# EAGLE design SuperNovaCore (EAGLE 8.7.1)
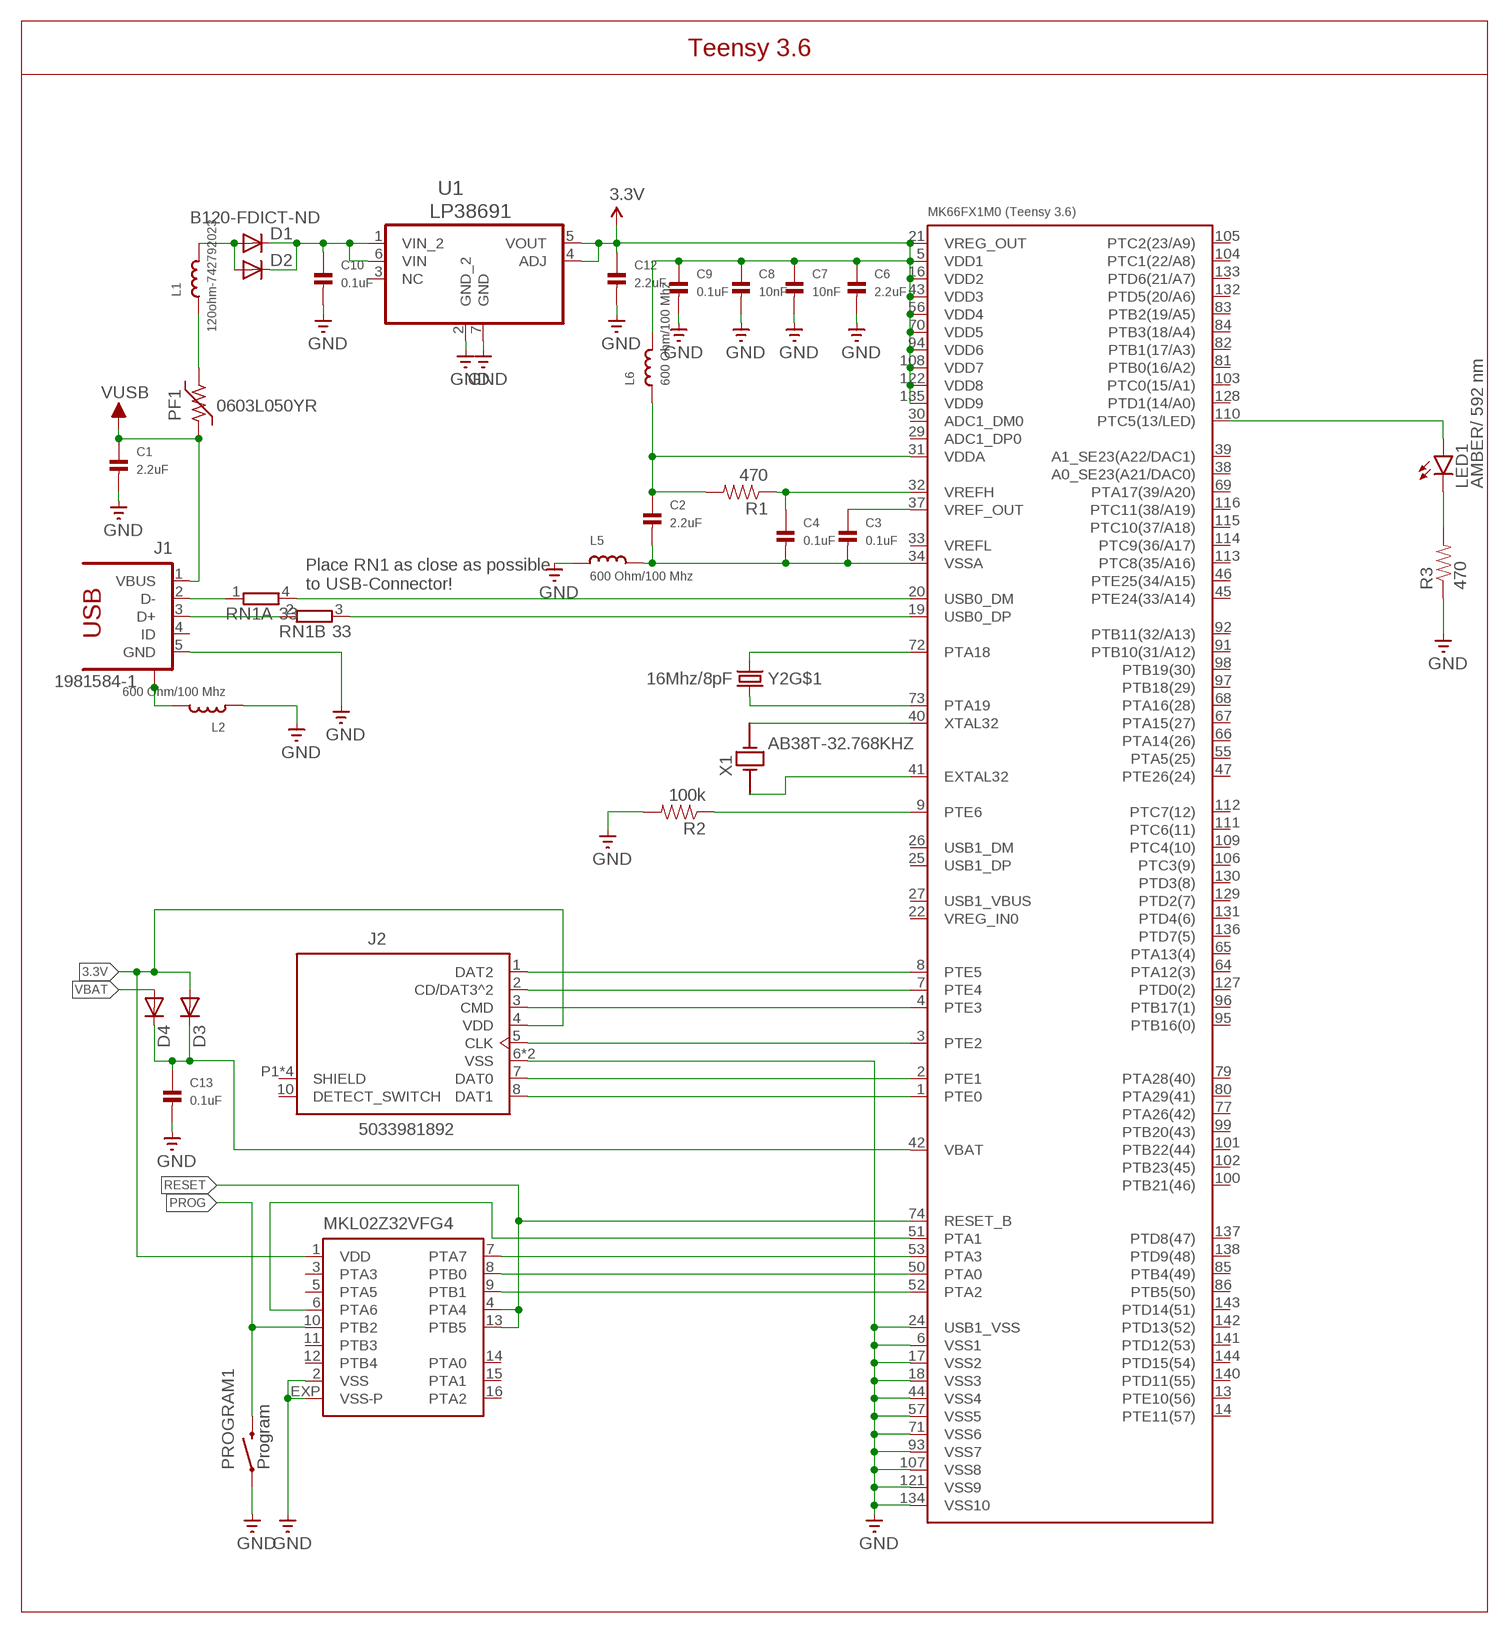
[diagram p0: schematic, sheet 1]

## Parts
C1  2.2uF  CAP_CERAMIC0603  [0603]
C2  2.2uF  CAP_CERAMIC0603  [0603]
C3  0.1uF  CAP_CERAMIC0603  [0603]
C4  0.1uF  CAP_CERAMIC0603  [0603]
C6  2.2uF  CAP_CERAMIC0603  [0603]
C7  10nF  CAP_CERAMIC0603  [0603]
C8  10nF  CAP_CERAMIC0603  [0603]
C9  0.1uF  CAP_CERAMIC0603  [0603]
C10  0.1uF  CAP_CERAMIC0603  [0603]
C12  2.2uF  CAP_CERAMIC0603  [0603]
C13  0.1uF  CAP_CERAMIC0603  [0603]
D1  B120-FDICT-ND  DIODE-DO214AC  [DO214AC]
D2  B120-FDICT-ND  DIODE-DO214AC  [DO214AC]
D3  B120-FDICT-ND  DIODE-DO214AC  [DO214AC]
D4  B120-FDICT-ND  DIODE-DO214AC  [DO214AC]
J1  1981584-1  [1981584-1]
J2  503398-1892  [MOLEX_503398-1892]
L1  120ohm-742792023  INDUCTOR-BK2125HM601-T  [0805]
L2  600 Ohm/100 Mhz  INDUCTOR-BK2125HM601-T  [0805]
L5  600 Ohm/100 Mhz  INDUCTOR-BK2125HM601-T  [0805]
L6  600 Ohm/100 Mhz  INDUCTOR-BK2125HM601-T  [0805]
LED1  AMBER/ 592 nm  LED-AMBER  [LED-0603]
PF1  0603L050YR  PTC-F0603  [F0603]
PROGRAM1  Program  SWITCH-MOMENTARY-2-SMD-1101NE  [TACTILE-SWITCH-1101NE]
R1  470  RESISTOR-470  [0603-RES]
R2  100k  RESISTOR-470  [0603-RES]
R3  470  RESISTOR-470  [0603-RES]
RN1  33  2R-NEXB34V  [EXB34V]
U1  LP38691SD-ADJ  [DFN300X300X80-7N]
U$1  MK66FX1M0  [LQFP144]
U$2  MKL02Z32VFG4  [QFN16]
X1  AB38T-32.768KHZ  [XTAL_AB38T-32.768KHZ]
Y2  16Mhz/8pF  CRYSTAL/SMD-5X3-GND16MHZ/8PF  [CRYSTAL-SMD-5X3]

## Nets
3.3V: C6.1 C7.1 C8.1 C9.1 C12.1 D3.A J2.4(VDD) L6.2 U1.4(ADJ) U1.5(VOUT) U$1.5(VDD1) U$1.16(VDD2) U$1.21(VREG_OUT) U$1.43(VDD3) U$1.56(VDD4) U$1.70(VDD5) U$1.94(VDD6) U$1.108(VDD7) U$1.122(VDD8) U$1.135(VDD9) U$2.1(VDD)
GND: C1.2 C6.2 C7.2 C8.2 C9.2 C10.2 C12.2 C13.2 J1.5(GND) J2.6(VSS) J2.9(VSS) L2.1 L5.1 PROGRAM1.P$1 R2.2 R3.1 U1.2(GND_2) U1.7(GND) U$1.6(VSS1) U$1.17(VSS2) U$1.18(VSS3) U$1.24(USB1_VSS) U$1.44(VSS4) U$1.57(VSS5) U$1.71(VSS6) U$1.93(VSS7) U$1.107(VSS8) U$1.121(VSS9) U$1.134(VSS10) U$2.2(VSS) U$2.EXP(VSS-P)
N$2: RN1.3 U$1.19(USB0_DP)
N$3: C10.1 D1.C D2.C U1.1(VIN_2) U1.6(VIN)
N$4: L1.1 PF1.2
N$5: D1.A D2.A L1.2
N$6: J2.1(DAT2) U$1.8(PTE5)
N$7: J2.2(CD/DAT3^2) U$1.7(PTE4)
N$8: RN1.4 U$1.20(USB0_DM)
N$9: C2.2 C3.2 C4.2 L5.2 U$1.34(VSSA)
N$10: C2.1 L6.1 R1.2 U$1.31(VDDA)
N$11: C4.1 R1.1 U$1.32(VREFH)
N$13: C3.1 U$1.37(VREF_OUT)
N$14: J2.3(CMD) U$1.4(PTE3)
N$16: J2.5(CLK) U$1.3(PTE2)
N$17: J2.7(DAT0) U$1.2(PTE1)
N$20: J2.8(DAT1) U$1.1(PTE0)
N$21: U$1.72(PTA18) Y2.3
N$23: C13.1 D3.C D4.C U$1.42(VBAT)
N$24: U$1.73(PTA19) Y2.1
N$25: U$1.40(XTAL32) X1.2
N$26: U$1.41(EXTAL32) X1.1
N$27: R2.1 U$1.9(PTE6)
N$28: U$1.51(PTA1) U$2.6(PTA6)
N$31: U$1.53(PTA3) U$2.7(PTA7)
N$32: U$1.50(PTA0) U$2.8(PTB0)
N$33: U$1.52(PTA2) U$2.9(PTB1)
N$37: LED1.A U$1.110(PTC5(13/LED))
N$38: LED1.C R3.2
PROG: PROGRAM1.P$2 U$2.10(PTB2)
RESET: U$1.74(RESET_B) U$2.4(PTA4) U$2.13(PTB5)
USB_CON_N [USB]: J1.2(D-) RN1.1
USB_CON_P [USB]: J1.3(D+) RN1.2
USB_SHIELD: J1.S1 J1.S2 J1.S3 J1.S4 L2.2
VBAT: D4.A
VUSB: C1.1 J1.1(VBUS) PF1.1
Unconnected: J1.4(ID) J2.10(DETECT_SWITCH) J2.P1(SHIELD) J2.P2(SHIELD) J2.P3(SHIELD) J2.P4(SHIELD) U1.3(NC) U$1.13(PTE10(56)) U$1.14(PTE11(57)) U$1.22(VREG_IN0) U$1.25(USB1_DP) U$1.26(USB1_DM) U$1.27(USB1_VBUS) U$1.29(ADC1_DP0) U$1.30(ADC1_DM0) U$1.33(VREFL) U$1.38(A0_SE23(A21/DAC0)) U$1.39(A1_SE23(A22/DAC1)) U$1.45(PTE24(33/A14)) U$1.46(PTE25(34/A15)) U$1.47(PTE26(24)) U$1.55(PTA5(25)) U$1.64(PTA12(3)) U$1.65(PTA13(4)) U$1.66(PTA14(26)) U$1.67(PTA15(27)) U$1.68(PTA16(28)) U$1.69(PTA17(39/A20)) U$1.77(PTA26(42)) U$1.79(PTA28(40)) U$1.80(PTA29(41)) U$1.81(PTB0(16/A2)) U$1.82(PTB1(17/A3)) U$1.83(PTB2(19/A5)) U$1.84(PTB3(18/A4)) U$1.85(PTB4(49)) U$1.86(PTB5(50)) U$1.91(PTB10(31/A12)) U$1.92(PTB11(32/A13)) U$1.95(PTB16(0)) U$1.96(PTB17(1)) U$1.97(PTB18(29)) U$1.98(PTB19(30)) U$1.99(PTB20(43)) U$1.100(PTB21(46)) U$1.101(PTB22(44)) U$1.102(PTB23(45)) U$1.103(PTC0(15/A1)) U$1.104(PTC1(22/A8)) U$1.105(PTC2(23/A9)) U$1.106(PTC3(9)) U$1.109(PTC4(10)) U$1.111(PTC6(11)) U$1.112(PTC7(12)) U$1.113(PTC8(35/A16)) U$1.114(PTC9(36/A17)) U$1.115(PTC10(37/A18)) U$1.116(PTC11(38/A19)) U$1.127(PTD0(2)) U$1.128(PTD1(14/A0)) U$1.129(PTD2(7)) U$1.130(PTD3(8)) U$1.131(PTD4(6)) U$1.132(PTD5(20/A6)) U$1.133(PTD6(21/A7)) U$1.136(PTD7(5)) U$1.137(PTD8(47)) U$1.138(PTD9(48)) U$1.140(PTD11(55)) U$1.141(PTD12(53)) U$1.142(PTD13(52)) U$1.143(PTD14(51)) U$1.144(PTD15(54)) U$2.3(PTA3) U$2.5(PTA5) U$2.11(PTB3) U$2.12(PTB4) U$2.14(PTA0) U$2.15(PTA1) U$2.16(PTA2) Y2.2(GND:GND) Y2.4(GND:GND)

## Notes on the sheet
- Teensy 3.6
- Place RN1 as close as possible
  to USB-Connector!

## Library data of the parts
C1-C4 C6-C10 C12 C13 = microbuilder:CAP_CERAMIC: Ceramic Capacitors 0402 - 0402 Surface Mount Capacitors 16pF 50V 5% [Digikey: 445-4899-2-ND] 18pF 50V 5% [Digikey: 490-1281-2-ND] 22pF 50V 5% [Digikey: 490-1283-2-ND] 68pF 50V 5% [Digikey: 490-1289-2-ND] 0.1uF 10V 10% [Digikey: 490-1318-2-ND] 1.0uF 6.3V 10% [Digikey: 490-1320-2-ND] 0603 - 0603 Surface Mount Capacitors 16 pF 50V 5% [Digikey: 445-5051-2-ND] 22 pF 50V [Digikey: PCC220ACVTR-ND] 33 pF 50V 5% [Digikey: 490-1415-1-ND] 56pF 50V 5% [Digikey: 490-1421-1-ND] 220pF 50V 5% [Digikey: 445-1285-1-ND] 680 pF 50V 2200 pF 50V 5% C0G [Digikey: 445-1297-1-ND] 5600 pF 100V 5% X7R [Digikey: 478-3711-1-ND] 0.1 µF 25V 10% [Digikey: PCC2277TR-ND] 0.22 µF 16V 10% X7R [Digikey: 445-1318-1-ND] 1.0 µF 25V 10% [Digikey: 445-5146-2-ND] 0603 - RF Specific 3pF 250V +/-0.1pF RF [Digikey: 712-1347-1-ND] 18 pF 250V 5% [Digikey: 478-3505-1-ND or 712-1322-1-ND] 56 pF 250V 5% C0G RF [Digikey: 490-4867-1-ND] 68 pF 250V RF [Digikey: 490-4868-1-ND] 0805 - 0805 Surface Mount Capacitors 220 pF 250V 2% RF Ceramic Capacitor [Digikey: 712-1398-1-ND] 1000 pF 50V 2% NP0 Ceramic Capacitor [Digikey: 478-3760-1-ND] 0.1 µF 25V 10% Ceramic Capacitor [Digikey: PCC1828TR-ND] 1.0 µF 16V 10% Ceramic Capacitor[Digikey: 490-1691-2-ND] 10.0 µF 10V 10% Ceramic Capacitor[Digikey: 709-1228-1-ND] 10.0 uF 16V 10% Ceramic Capacitor [Digikey: 478-5165-2-ND] 47 uF 6.3V 20% Ceramic Capacitor [Digikey: 587-1779-1-ND or 399-5506-1-ND] 1206 - 1206 Surface Mount Capacitors 47uF 10V 20% Ceramic Capacitor [Digikey: 490-5528-1-ND or 399-5508-1-ND or 445-6010-1-ND]
D1-D4 = diode:DIODE-: DIODE
J1 = con-usb:1981584-1: Receptacle, micro-USB, type A/B Tyco Electronics; MF: Hirose; MPN: ZX62-AB-5PA(11)
J2 = Shawn'sCustomComponents:503398-1892: 1.10mm Pitch microSD Memory Card Connector, Normal Mount Surface Mount, Push-Push Type, 1.28mm Height; AVAILABILITY: Unavailable; DESCRIPTION: 9 _8 + 1_ Position Card Connector microSD™ Surface Mount, Right Angle Gold; MF: Molex; MP: 5033981892; PACKAGE: None; PRICE: None
L1 = appfruits:INDUCTOR: Inductors 0603: 10nH Ceramic Inductor - microwire antenna/RF (Digikey: 712-1434-2-ND) 0805: 560nH Ceramic Inductor - RF (Digikey: 553-1047-1-ND) 270nH Ceramic Inductor - Q = 40@250MHz, +-5%, 1 Ohm DC Resistance (Digikey: 535-10506-2-ND) 1007 (2518 Metric) SMT: 10µH 10% 250mOhm 820mA 1007 Inductor (Digikey: 587-2189-1-ND) 22µH 10% 500mOhm 580mA 1007 Inductor (Digikey: 587-2190-1-ND) 47µH 10% 950mOhm 420mA 1007 Inductor (Digikey: 587-2191-1-ND) 47µH 5% 100mOhm 1A 1008 Inductor (Digikey: 732-1816-1-ND) 5.0x5.0mm (Taiyo Yuden NR5040 Series) 6.8µH 20% 2.3A 64mOhm Inductor (Digikey: 587-2374-2-ND) 5.0x5.0mm (TDK VLC5045 Series) 4.7µH 20% 3.3A 34mOhm Inductor (Digikey: 445-6526-1-ND) 6.8µH 20% 2.7A 46mOhm Inductor (Digikey: 445-6527-1-ND) 6.0x6.0mm (TDK VLC6045 Series) 4.7µH 20% 3.8A 27mOhm Inductor (Digikey: 445-6538-2-ND) 6.8µH 20% 3A 41mOhm Inductor (Digikey: 445-6540-1-ND) 6.2µH 30% 2.2A 45mOhm Inductor (Digikey: SRR5028-6R2YCT-ND) - Not TDK VLC6045 but footprint should match 6.0x6.0mm (TDK SLF6045 Series) 6.8uH 30% 2A 33mOhm Inductor (Digikey: 445-4572-1-ND, Mouser: 810-SLF645T6R8N2R0PF) 6.0x6.0mm (Sumida CDRH5D28 Series) 6.2uH 30% 1.8A 45mOhm Inductor (Digikey: 308-1542-1-ND) Taiyo Yuden NR3015T2R2M - 2.2uH 20% 1.5A (Digikey: 587-1648-2-ND, Mouser: 963-NR3015T2R2M) - Used with TI TPS62172 CoilCraft RFID Transponder Coil - MA5532-AE (For use with AS3935 Lightning Sensor); MF: Taiyo Yuden; MPN: BK2125HM601-T; VALUE: 600 Ohm/100 Mhz
L2 L5 L6 = appfruits:INDUCTOR: Inductors 0603: 10nH Ceramic Inductor - microwire antenna/RF (Digikey: 712-1434-2-ND) 0805: 560nH Ceramic Inductor - RF (Digikey: 553-1047-1-ND) 270nH Ceramic Inductor - Q = 40@250MHz, +-5%, 1 Ohm DC Resistance (Digikey: 535-10506-2-ND) 1007 (2518 Metric) SMT: 10µH 10% 250mOhm 820mA 1007 Inductor (Digikey: 587-2189-1-ND) 22µH 10% 500mOhm 580mA 1007 Inductor (Digikey: 587-2190-1-ND) 47µH 10% 950mOhm 420mA 1007 Inductor (Digikey: 587-2191-1-ND) 47µH 5% 100mOhm 1A 1008 Inductor (Digikey: 732-1816-1-ND) 5.0x5.0mm (Taiyo Yuden NR5040 Series) 6.8µH 20% 2.3A 64mOhm Inductor (Digikey: 587-2374-2-ND) 5.0x5.0mm (TDK VLC5045 Series) 4.7µH 20% 3.3A 34mOhm Inductor (Digikey: 445-6526-1-ND) 6.8µH 20% 2.7A 46mOhm Inductor (Digikey: 445-6527-1-ND) 6.0x6.0mm (TDK VLC6045 Series) 4.7µH 20% 3.8A 27mOhm Inductor (Digikey: 445-6538-2-ND) 6.8µH 20% 3A 41mOhm Inductor (Digikey: 445-6540-1-ND) 6.2µH 30% 2.2A 45mOhm Inductor (Digikey: SRR5028-6R2YCT-ND) - Not TDK VLC6045 but footprint should match 6.0x6.0mm (TDK SLF6045 Series) 6.8uH 30% 2A 33mOhm Inductor (Digikey: 445-4572-1-ND, Mouser: 810-SLF645T6R8N2R0PF) 6.0x6.0mm (Sumida CDRH5D28 Series) 6.2uH 30% 1.8A 45mOhm Inductor (Digikey: 308-1542-1-ND) Taiyo Yuden NR3015T2R2M - 2.2uH 20% 1.5A (Digikey: 587-1648-2-ND, Mouser: 963-NR3015T2R2M) - Used with TI TPS62172 CoilCraft RFID Transponder Coil - MA5532-AE (For use with AS3935 Lightning Sensor); MF: Taiyo Yuden; MPN: BK2125HM601-T
LED1 = appfruits:LED: LEDs Standard schematic elements and footprints for 5mm, 3mm, 1206, and 0603 sized LEDs. 5mm - Spark Fun Electronics SKU : COM-00529 (and others); MF: Avago Technologies; MPN: HSMA-C190
PF1 = polyswitch:PTC-: POLYSWITCH Polyswitch Resetable Fuses
PROGRAM1 = SparkFun-Electromechanical:SWITCH-MOMENTARY-2: Various NO switches- pushbuttons, reed, etc; MF: C&K Components; MPN: RS-282G05A3-SM RT
R1 R3 = appfruits:RESISTOR: Resistor Basic schematic elements and footprints for 0603, 1206, and PTH resistors.; MF: Panasonic; MPN: ERJ-3GEYJ471V
R2 = appfruits:RESISTOR: Resistor Basic schematic elements and footprints for 0603, 1206, and PTH resistors.; MF: Panasonic; MPN: ERJ-3GEYJ471V; VALUE: 470
RN1 = resistor-dil:2R-N: Array Chip Resistor Source: Panasonic; MF: Panasonic; MPN: EXB-34V330JV; OC_FARNELL: unknown; OC_NEWARK: unknown
U1 = Shawn'sCustomComponents:LP38691SD-ADJ: Linear Regulator; AVAILABILITY: Unavailable; DESCRIPTION: Linear Voltage Regulator IC 1 Output 500mA 6-WSON _3x3_; MF: Texas Instruments; MP: LP38691SD-ADJ; PACKAGE: WDFN-6 Texas Instruments; PRICE: None
U$1 = Shawn'sCustomComponents:MK66FX1M0: 180 MHz ARM® Cortex®-M4F Microcontroller
U$2 = Shawn'sCustomComponents:MKL02Z32VFG4
X1 = Shawn'sCustomComponents:AB38T-32.768KHZ: AB38T Series 32.768 kHz ±20 ppm 12.5 pF -10 to +60 °C Tuning Fork Crystal; DESCRIPTION: 32.768kHz ±15ppm Crystal 12.5pF 30 kOhms Cylindrical Can, Radial; DIGI-KEY_PART_NUMBER: 535-14327-ND; DIGI-KEY_PURCHASE_URL: https://www.digikey.com/product-detail/en/abracon-llc/AB38T-32.768KHZ-B7/535-14327-ND/8581951?utm_source=snapeda&utm_medium=aggregator&utm_campaign=symbol; MF: Abracon; MP: AB38T-32.768KHZ; PACKAGE: Cylindrical Can Radial Abracon
Y2 = appfruits:CRYSTAL/SMD-5X3-GND; MF: ECS; MPN: ECS-160-8-30B-CKM

## Net classes
1 USB: width 0.254 mm, drill 0.33 mm, clearance 0.159 mm

## Board
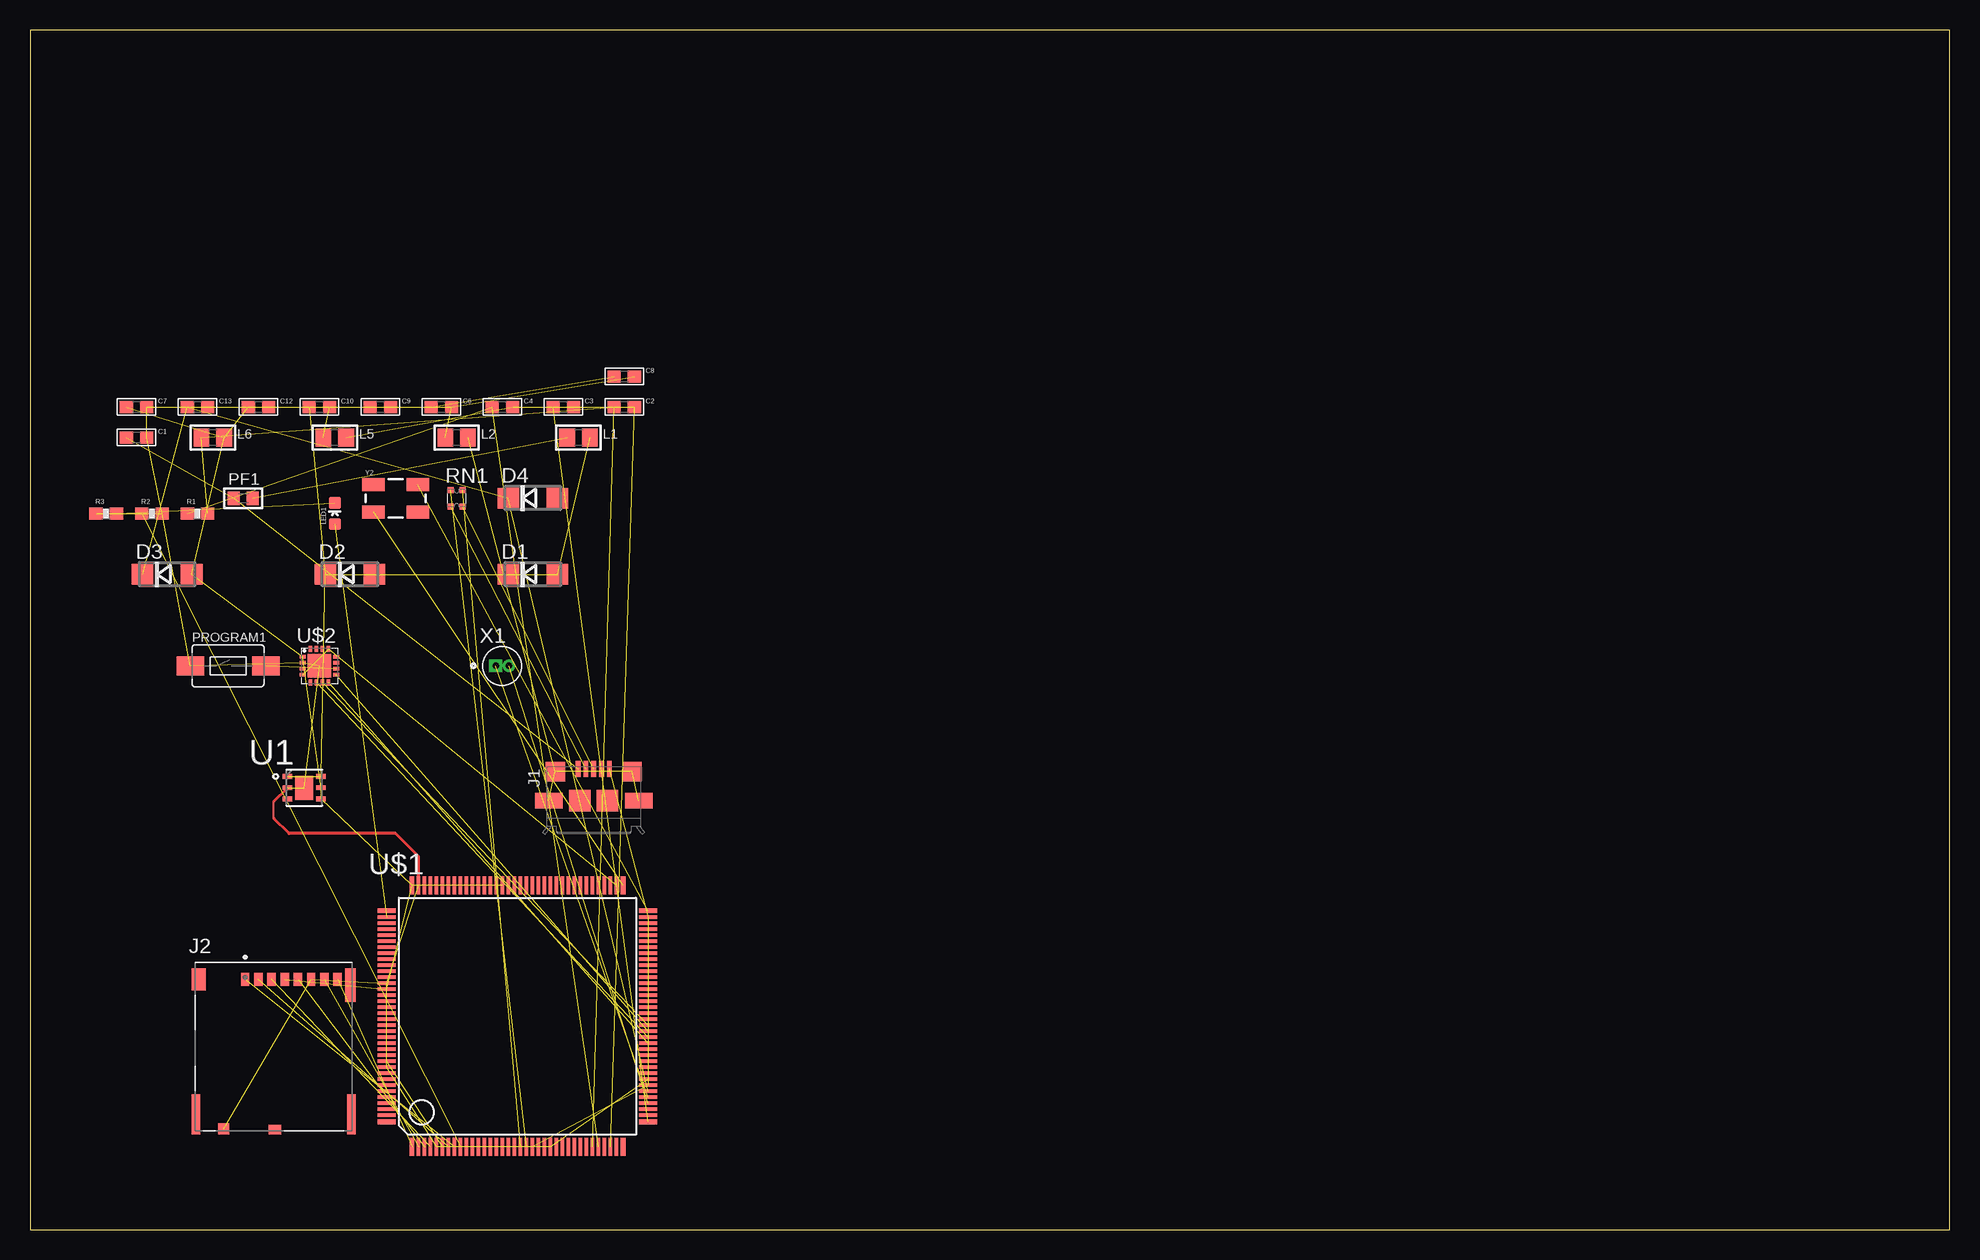
[diagram p1: board, top side]

Size 160 x 100 mm. Coordinates in mm from the lower left corner, seen from the top.
Outline: 0,0 160,0 160,100 0,100 0,0
Copper layers (1*16): Top 0.035mm / dielectric 1.5mm / Bottom 0.035mm
Design rules "default": minimum track width 6mil, minimum drill 0.35mm, track to track 6mil, track to pad 6mil, pad to pad 6mil, via to via 6mil, smd to smd 6mil, copper to edge 40mil, drill to drill 6mil, minimum pad ring 10mil, minimum via ring 8mil, stop-mask expansion 4mil, vias tented up to drill 0mil, thermal gap 10mil

### Footprints (pad centres in the part's own frame; a part is rotated, then mirrored left to right if it is on the bottom)
0603 = smd 1.1 x 1: 1 -0.85,0; 2 0.85,0
DO214AC = smd 1.8 x 1.7: A 2.05,0; C -2.05,0
1981584-1 = smd 0.4 x 1.35: 1 -1.3,4.1; 2 -0.65,4.1; 3 0,4.1; 4 0.65,4.1; 5 1.3,4.1 | smd 1.8 x 1.8: M1 -1.15,1.45; M2 1.15,1.45 | smd 2.3 x 1.3: S1 -3.75,1.45; S2 3.75,1.45 | smd 1.6 x 1.6: S3 -3.2,3.885; S4 3.2,3.885
MOLEX_503398-1892 = smd 0.7 x 1.1: 1 -2.38,5.625; 2 -1.28,5.625; 3 -0.18,5.625; 4 0.92,5.625; 5 2.02,5.625; 6 3.12,5.625; 7 4.22,5.625; 8 5.32,5.625 | smd 0.9 x 0.93: 9 -4.17,-6.84 | smd 1.05 x 0.78: 10 0.095,-6.915 | smd 1.14 x 1.83: P1 -6.26,5.61 | smd 0.86 x 2.8: P2 6.4,5.125 | smd 0.7 x 3.33: P3 -6.48,-5.64; P4 6.48,-5.64
0805 = smd 1.3 x 1.5: 1 -0.95,0; 2 0.95,0
LED-0603 = smd 1 x 1: A 0,-0.877; C 0,0.877
F0603 = smd 1 x 1.1: 1 -0.794,0; 2 0.794,0
TACTILE-SWITCH-1101NE = smd 2.3 x 1.6: P$1 -3.15,0; P$2 3.15,0
0603-RES = smd 1.1 x 1: 1 -0.85,0; 2 0.85,0
EXB34V = smd 0.5 x 0.5: 1 -0.5,-0.7; 2 0.5,-0.7; 3 0.5,0.7; 4 -0.5,0.7
DFN300X300X80-7N = smd 0.813 x 0.406: 1 -1.397,0.94; 2 -1.397,0; 3 -1.397,-0.94; 4 1.397,-0.94; 5 1.397,0; 6 1.397,0.94 | smd 1.499 x 2.007: 7 -0.025,-0.025
LQFP144 = smd 0.4 x 1.5: 1 -8.8,-10.9; 36 8.8,-10.9; 73 8.8,10.9; 108 -8.8,10.9 | smd 0.3 x 1.5: 2 -8.25,-10.9; 3 -7.75,-10.9; 4 -7.25,-10.9; 5 -6.75,-10.9; 6 -6.25,-10.9; 7 -5.75,-10.9; 8 -5.25,-10.9; 9 -4.75,-10.9; 10 -4.25,-10.9; 11 -3.75,-10.9; 12 -3.25,-10.9; 13 -2.75,-10.9; 14 -2.25,-10.9; 15 -1.75,-10.9; 16 -1.25,-10.9; 17 -0.75,-10.9; 18 -0.25,-10.9; 19 0.25,-10.9; 20 0.75,-10.9; 21 1.25,-10.9; 22 1.75,-10.9; 23 2.25,-10.9; 24 2.75,-10.9; 25 3.25,-10.9; 26 3.75,-10.9; 27 4.25,-10.9; 28 4.75,-10.9; 29 5.25,-10.9; 30 5.75,-10.9; 31 6.25,-10.9; 32 6.75,-10.9; 33 7.25,-10.9; 34 7.75,-10.9; 35 8.25,-10.9; 74 8.25,10.9; 75 7.75,10.9; 76 7.25,10.9; 77 6.75,10.9; 78 6.25,10.9; 79 5.75,10.9; 80 5.25,10.9; 81 4.75,10.9; 82 4.25,10.9; 83 3.75,10.9; 84 3.25,10.9; 85 2.75,10.9; 86 2.25,10.9; 87 1.75,10.9; 88 1.25,10.9; 89 0.75,10.9; 90 0.25,10.9; 91 -0.25,10.9; 92 -0.75,10.9; 93 -1.25,10.9; 94 -1.75,10.9; 95 -2.25,10.9; 96 -2.75,10.9; 97 -3.25,10.9; 98 -3.75,10.9; 99 -4.25,10.9; 100 -4.75,10.9; 101 -5.25,10.9; 102 -5.75,10.9; 103 -6.25,10.9; 104 -6.75,10.9; 105 -7.25,10.9; 106 -7.75,10.9; 107 -8.25,10.9 | smd 1.5 x 0.4: 37 10.9,-8.8; 72 10.9,8.8; 109 -10.9,8.8; 144 -10.9,-8.8 | smd 1.5 x 0.3: 38 10.9,-8.25; 39 10.9,-7.75; 40 10.9,-7.25; 41 10.9,-6.75; 42 10.9,-6.25; 43 10.9,-5.75; 44 10.9,-5.25; 45 10.9,-4.75; 46 10.9,-4.25; 47 10.9,-3.75; 48 10.9,-3.25; 49 10.9,-2.75; 50 10.9,-2.25; 51 10.9,-1.75; 52 10.9,-1.25; 53 10.9,-0.75; 54 10.9,-0.25; 55 10.9,0.25; 56 10.9,0.75; 57 10.9,1.25; 58 10.9,1.75; 59 10.9,2.25; 60 10.9,2.75; 61 10.9,3.25; 62 10.9,3.75; 63 10.9,4.25; 64 10.9,4.75; 65 10.9,5.25; 66 10.9,5.75; 67 10.9,6.25; 68 10.9,6.75; 69 10.9,7.25; 70 10.9,7.75; 71 10.9,8.25; 110 -10.9,8.25; 111 -10.9,7.75; 112 -10.9,7.25; 113 -10.9,6.75; 114 -10.9,6.25; 115 -10.9,5.75; 116 -10.9,5.25; 117 -10.9,4.75; 118 -10.9,4.25; 119 -10.9,3.75; 120 -10.9,3.25; 121 -10.9,2.75; 122 -10.9,2.25; 123 -10.9,1.75; 124 -10.9,1.25; 125 -10.9,0.75; 126 -10.9,0.25; 127 -10.9,-0.25; 128 -10.9,-0.75; 129 -10.9,-1.25; 130 -10.9,-1.75; 131 -10.9,-2.25; 132 -10.9,-2.75; 133 -10.9,-3.25; 134 -10.9,-3.75; 135 -10.9,-4.25; 136 -10.9,-4.75; 137 -10.9,-5.25; 138 -10.9,-5.75; 139 -10.9,-6.25; 140 -10.9,-6.75; 141 -10.9,-7.25; 142 -10.9,-7.75; 143 -10.9,-8.25
QFN16 = smd 0.5 x 0.3: 1 -1.4,0.75; 2 -1.4,0.25; 3 -1.4,-0.25; 4 -1.4,-0.75; 9 1.4,-0.75; 10 1.4,-0.25; 11 1.4,0.25; 12 1.4,0.75 | smd 0.3 x 0.5: 5 -0.75,-1.4; 6 -0.25,-1.4; 7 0.25,-1.4; 8 0.75,-1.4; 13 0.75,1.4; 14 0.25,1.4; 15 -0.25,1.4; 16 -0.75,1.4 | smd 1.95 x 1.95: EXP 0,0
XTAL_AB38T-32.768KHZ = drill 0.55 pad 0.925 square: 1 -0.55,0 | drill 0.55 pad 0.925: 2 0.55,0
CRYSTAL-SMD-5X3 = smd 1.9 x 1.1: 1 -1.85,-1.15; 2 1.85,-1.15; 3 1.85,1.15; 4 -1.85,1.15

### Placement (x,y rotation side)
C1  8.89,66.04 0 top
C2  49.53,68.58 0 top
C3  44.45,68.58 0 top
C4  39.37,68.58 0 top
C6  34.29,68.58 0 top
C7  8.89,68.58 0 top
C8  49.53,71.12 0 top
C9  29.21,68.58 0 top
C10  24.13,68.58 0 top
C12  19.05,68.58 0 top
C13  13.97,68.58 0 top
D1  41.91,54.61 0 top
D2  26.67,54.61 0 top
D3  11.43,54.61 0 top
D4  41.91,60.96 0 top
J1  46.99,34.29 0 top
J2  20.32,15.24 0 top
L1  45.72,66.04 0 top
L2  35.56,66.04 0 top
L5  25.4,66.04 0 top
L6  15.24,66.04 0 top
LED1  25.4,59.69 0 top
PF1  17.78,60.96 0 top
PROGRAM1  16.51,46.99 0 top
R1  13.97,59.69 0 top
R2  10.16,59.69 0 top
R3  6.35,59.69 0 top
RN1  35.56,60.96 0 top
U1  22.86,36.83 0 top
U$1  40.64,17.78 0 top
U$2  24.13,46.99 0 top
X1  39.37,46.99 0 top
Y2  30.48,60.96 0 top

### Tracks (layer width: path | path; a pad name or v marks a point on that pad's centre or on a via)
3.3V  (20 unrouted)
GND  (29 unrouted)
  Top 0.152: 20.32,34.29 20.32,35.69
  Top 0.254: U$1.107 32.39,31.11 30.48,33.02 21.59,33.02 20.32,34.29 | 20.32,35.69 U1.2
N$2  (1 unrouted)
N$3  (4 unrouted)
N$4  (1 unrouted)
N$5  (2 unrouted)
N$6  (1 unrouted)
N$7  (1 unrouted)
N$8  (1 unrouted)
N$9  (4 unrouted)
N$10  (3 unrouted)
N$11  (2 unrouted)
N$13  (1 unrouted)
N$14  (1 unrouted)
N$16  (1 unrouted)
N$17  (1 unrouted)
N$20  (1 unrouted)
N$21  (1 unrouted)
N$23  (3 unrouted)
N$24  (1 unrouted)
N$25  (1 unrouted)
N$26  (1 unrouted)
N$27  (1 unrouted)
N$28  (1 unrouted)
N$31  (1 unrouted)
N$32  (1 unrouted)
N$33  (1 unrouted)
N$37  (1 unrouted)
N$38  (1 unrouted)
PROG  (1 unrouted)
RESET  (2 unrouted)
USB_CON_N  (1 unrouted)
USB_CON_P  (1 unrouted)
USB_SHIELD  (4 unrouted)
VUSB  (2 unrouted)